# EAGLE design Circuit (EAGLE 5.00)
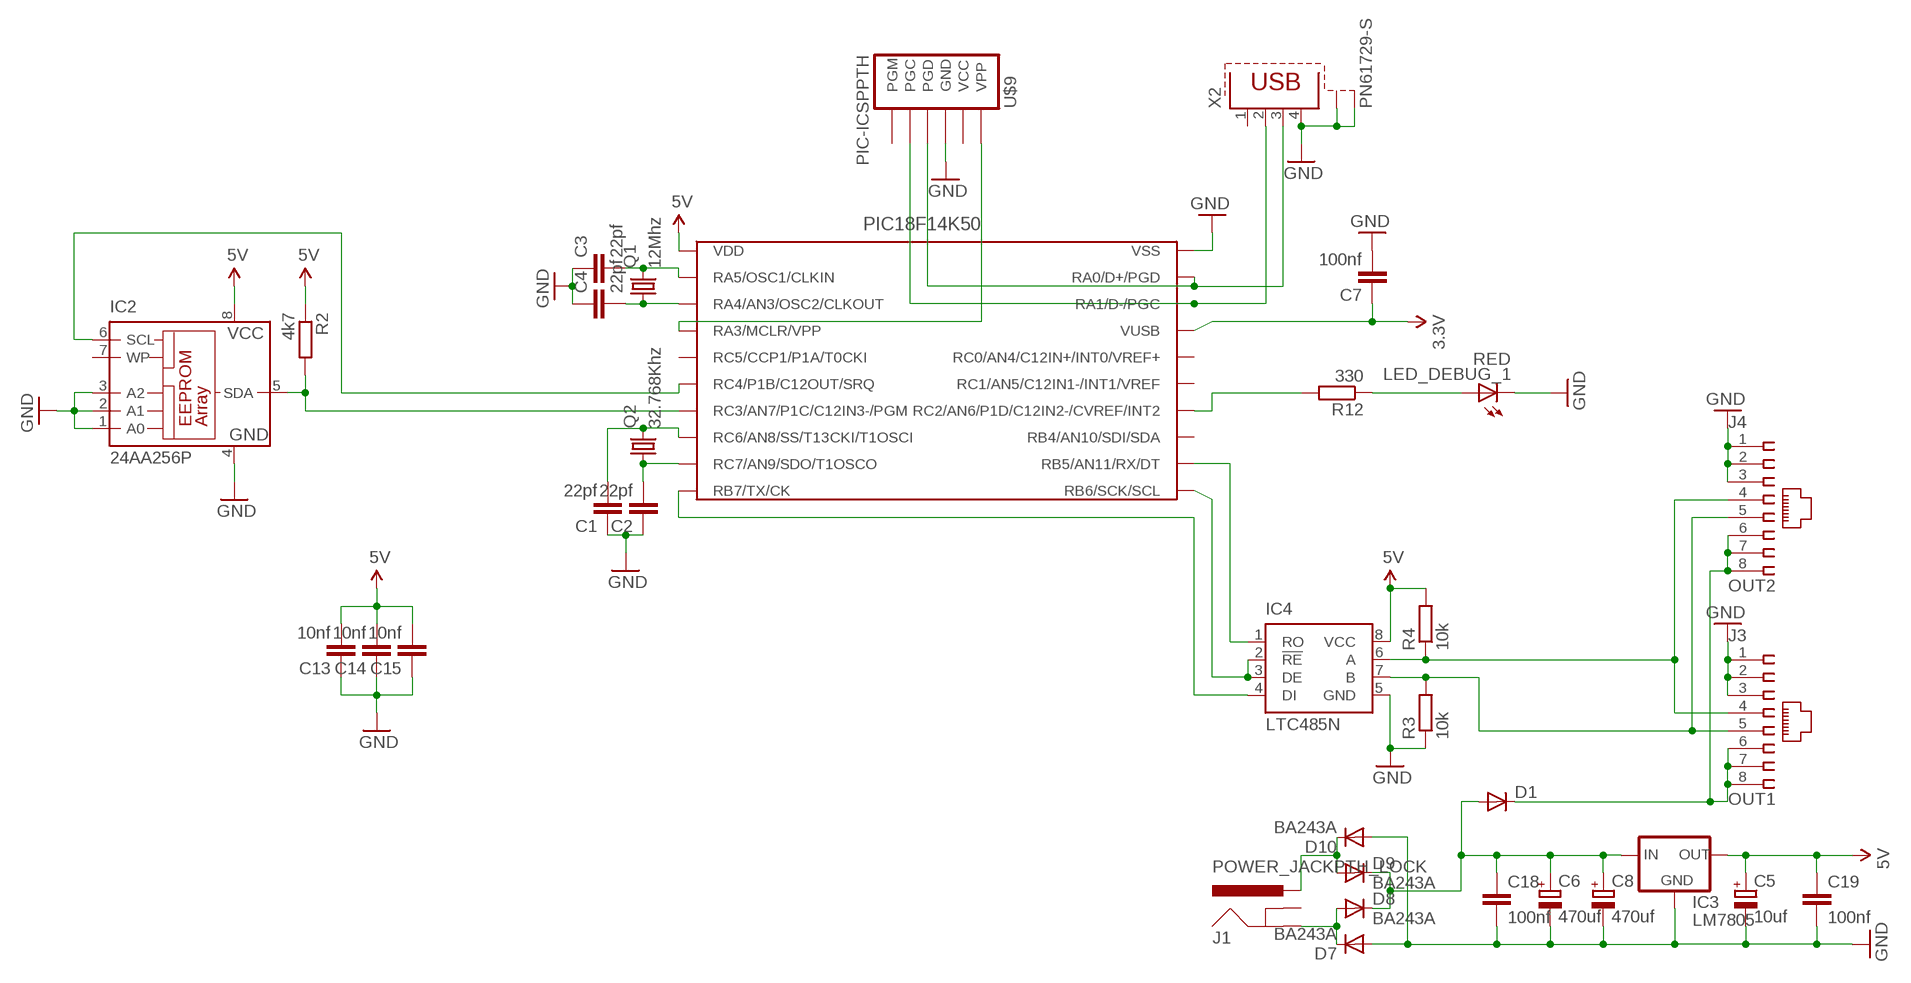
[diagram p0: schematic, sheet 1]

## Parts
C1  22pf  C-EU050-025X075  [C050-025X075]
C2  22pf  C-EU050-025X075  [C050-025X075]
C3  22pf  C-EU050-025X075  [C050-025X075]
C4  22pf  C-EU050-025X075  [C050-025X075]
C5  10uf  CPOL-EUE2.5-5  [E2,5-5]
C6  470uf  CPOL-EUE3.5-10  [E3,5-10]
C7  100nf  C2.5/2  [C2.5-2]
C8  470uf  CPOL-EUE3.5-10  [E3,5-10]
C13  10nf  C-EU050-025X075  [C050-025X075]
C14  10nf  C-EU050-025X075  [C050-025X075]
C15  10nf  C-EU050-025X075  [C050-025X075]
C18  100nf  C-EU050-025X075  [C050-025X075]
C19  100nf  C-EU050-025X075  [C050-025X075]
D1  DIODE-DO35-10  [DO35-10]
D7  BA243A  [DO35-10]
D8  BA243A  [DO35-10]
D9  BA243A  [DO35-10]
D10  BA243A  [DO35-10]
IC2  24AA256P  [DIL8]
IC3  LM7805  78XXL  [78XXL]
IC4  LTC485N  [DIL08]
J1  POWER_JACKPTH_LOCK  [POWER_JACK_PTH_LOCK]
J3  OUT1  215877-4  [215877-4]
J4  OUT2  215877-4  [215877-4]
LED_DEBUG_1  RED  LED5MM  [LED5MM]
Q1  12Mhz  CRYSTALHC49U70  [HC49U70]
Q2  32.768Khz  CRYSTALTC38H  [TC38H]
R2  4k7  R-EU_0204/7  [0204/7]
R3  10k  R-EU_0204/7  [0204/7]
R4  10k  R-EU_0204/7  [0204/7]
R12  330  R-EU_0204/7  [0204/7]
U$1  D.2.18F14K50  [E.18F14K50]
U$9  PIC-ICSPPTH  [MOLEX-1X6]
X2  PN61729-S  [PN61729-S]

## Nets
3.3V: C7.1 U$1.VUSB
5V: C5.+ C13.2 C14.2 C15.2 C19.1 IC2.8(VCC) IC3.OUT IC4.8(VCC) R2.1 R4.2 U$1.VDD
12V: C6.+ C8.+ C18.1 D1.A D8.C D9.C IC3.IN
GND: C1.1 C2.1 C3.1 C4.1 C5.- C6.- C7.2 C8.- C13.1 C14.1 C15.1 C18.2 C19.2 D7.A D10.A IC2.1(A0) IC2.2(A1) IC2.3(A2) IC2.4(GND) IC3.GND IC4.5(GND) J3.1 J3.2 J3.3 J4.1 J4.2 J4.3 LED_DEBUG_1.K(C) R3.1 U$1.VSS U$9.4(GND) X2.4 X2.S1 X2.S2
N$1: IC2.6(SCL) U$1.RC4/P1B/C12OUT/SRQ
N$2: LED_DEBUG_1.A R12.1
N$4: D7.C D8.A J1.GND
N$5: IC4.1(RO) U$1.RB5/AN11/RX/DT
N$6: IC4.6(A) J3.4 J4.4 R4.1
N$7: IC4.2(!RE) IC4.3(DE) U$1.RB6/SCK/SCL
N$8: D9.A D10.C J1.PWR
N$9: C1.2 Q2.2 U$1.RC6/AN8/SS/T13CKI/T1OSCI
N$10: C2.2 Q2.1 U$1.RC7/AN9/SDO/T1OSCO
N$12: IC2.5(SDA) R2.2 U$1.RC3/AN7/P1C/C12IN3-/PGM
N$13: IC4.7(B) J3.5 J4.5 R3.2
N$14: C4.2 Q1.1 U$1.RA4/AN3/OSC2/CLKOUT
N$15: C3.2 Q1.2 U$1.RA5/OSC1/CLKIN
N$19: D1.C J3.6 J3.7 J3.8 J4.6 J4.7 J4.8
N$28: U$1.RA3/MCLR/VPP U$9.6(VPP)
N$38: U$1.RA0/D+/PGD U$9.3(PGD) X2.3
N$39: U$1.RA1/D-/PGC U$9.2(PGC) X2.2
N$41: IC4.4(DI) U$1.RB7/TX/CK
N$67: R12.2 U$1.RC2/AN6/P1D/C12IN2-/CVREF/INT2
Unconnected: IC2.7(WP) J1.GNDBREAK U$1.RB4/AN10/SDI/SDA U$1.RC0/AN4/C12IN+/INT0/VREF+ U$1.RC1/AN5/C12IN1-/INT1/VREF U$1.RC5/CCP1/P1A/T0CKI U$9.1(PGM) U$9.5(VCC) X2.1

## Library data of the parts
C1-C4 C13-C15 C18 C19 = rcl:C-EU: CAPACITOR, European symbol
C5 C6 C8 = rcl:CPOL-EU: POLARIZED CAPACITOR, European symbol
C7 = capacitor-wima:C: CAPACITOR naming: grid - package width
D1 = diode:DIODE-: DIODE
D7-D10 = diode:BA243A: DIODE
IC2 = microchip:24*: Serial EEPROM I2C
IC3 = v-reg:78XXL: VOLTAGE REGULATOR
IC4 = linear-technology:LTC485: Low Power RS485 Interface Transceiver Source: http://www.linear.com/pc/downloadDocument.do?navId=H0,C1,C1007,C1017,P2064,D1718
J1 = SparkFun:POWER_JACK: Power Jack This is the standard 5.5mm barrel jack for power. The PTH is the most common, proven, reliable, footprint. All others are experimental. The Slot footprint only works if the mill layer is transmitted to the PCB fab house so be warned. Spark Fun Electronics SKU : PRT-00119. Mating wall wart : TOL-00298 (and others)
J3 J4 = con-amp:215877-4: AMP connector
LED_DEBUG_1 = led:LED: LED OSRAM: - CHIPLED LG R971, LG N971, LY N971, LG Q971, LY Q971, LO R971, LY R971 LH N974, LH R974 LS Q976, LO Q976, LY Q976 LO Q996 - Hyper CHIPLED LW Q18S LB Q993, LB Q99A, LB R99A - SideLED LS A670, LO A670, LY A670, LG A670, LP A670 LB A673, LV A673, LT A673, LW A673 LH A674 LY A675 LS A676, LA A676, LO A676, LY A676, LW A676 LS A679, LY A679, LG A679 - Hyper Micro SIDELED® LS Y876, LA Y876, LO Y876, LY Y876 LT Y87S - SmartLED LW L88C, LW L88S LB L89C, LB L89S, LG L890 LS L89K, LO L89K, LY L89K LS L896, LA L896, LO L896, LY L896 - TOPLED LS T670, LO T670, LY T670, LG T670, LP T670 LSG T670, LSP T670, LSY T670, LOP T670, LYG T670 LG T671, LOG T671, LSG T671 LB T673, LV T673, LT T673, LW T673 LH T674 LS T676, LA T676, LO T676, LY T676, LB T676, LH T676, LSB T676, LW T676 LB T67C, LV T67C, LT T67C, LS T67K, LO T67K, LY T67K, LW E67C LS E67B, LA E67B, LO E67B, LY E67B, LB E67C, LV E67C, LT E67C LW T67C LS T679, LY T679, LG T679 LS T770, LO T770, LY T770, LG T770, LP T770 LB T773, LV T773, LT T773, LW T773 LH T774 LS E675, LA E675, LY E675, LS T675 LS T776, LA T776, LO T776, LY T776, LB T776 LHGB T686 LT T68C, LB T68C - Hyper Mini TOPLED® LB M676 - Mini TOPLED Santana® LG M470 LS M47K, LO M47K, LY M47K Source: http://www.osram.convergy.de LUXEON: - LUMILED® LXK2-PW12-R00, LXK2-PW12-S00, LXK2-PW14-U00, LXK2-PW14-V00 LXK2-PM12-R00, LXK2-PM12-S00, LXK2-PM14-U00 LXK2-PE12-Q00, LXK2-PE12-R00, LXK2-PE12-S00, LXK2-PE14-T00, LXK2-PE14-U00 LXK2-PB12-K00, LXK2-PB12-L00, LXK2-PB12-M00, LXK2-PB14-N00, LXK2-PB14-P00, LXK2-PB14-Q00 LXK2-PR12-L00, LXK2-PR12-M00, LXK2-PR14-Q00, LXK2-PR14-R00 LXK2-PD12-Q00, LXK2-PD12-R00, LXK2-PD12-S00 LXK2-PH12-R00, LXK2-PH12-S00 LXK2-PL12-P00, LXK2-PL12-Q00, LXK2-PL12-R00 Source: www.luxeon.com KINGBRIGHT: KA-3528ASYC Source: www.kingbright.com
Q1 Q2 = crystal:CRYSTAL: CRYSTAL
R2 = resistor:R-EU_: RESISTOR, European symbol
R3 R4 R12 = rcl:R-EU_: RESISTOR, European symbol
U$1 = pic18f14k50:D.2.18F14K50
U$9 = SparkFun:PIC-ICSP: ISCP Programming connector for UAV, UBW Kit, etc.
X2 = con-berg:PN61729-S: BERG USB connector

## Board
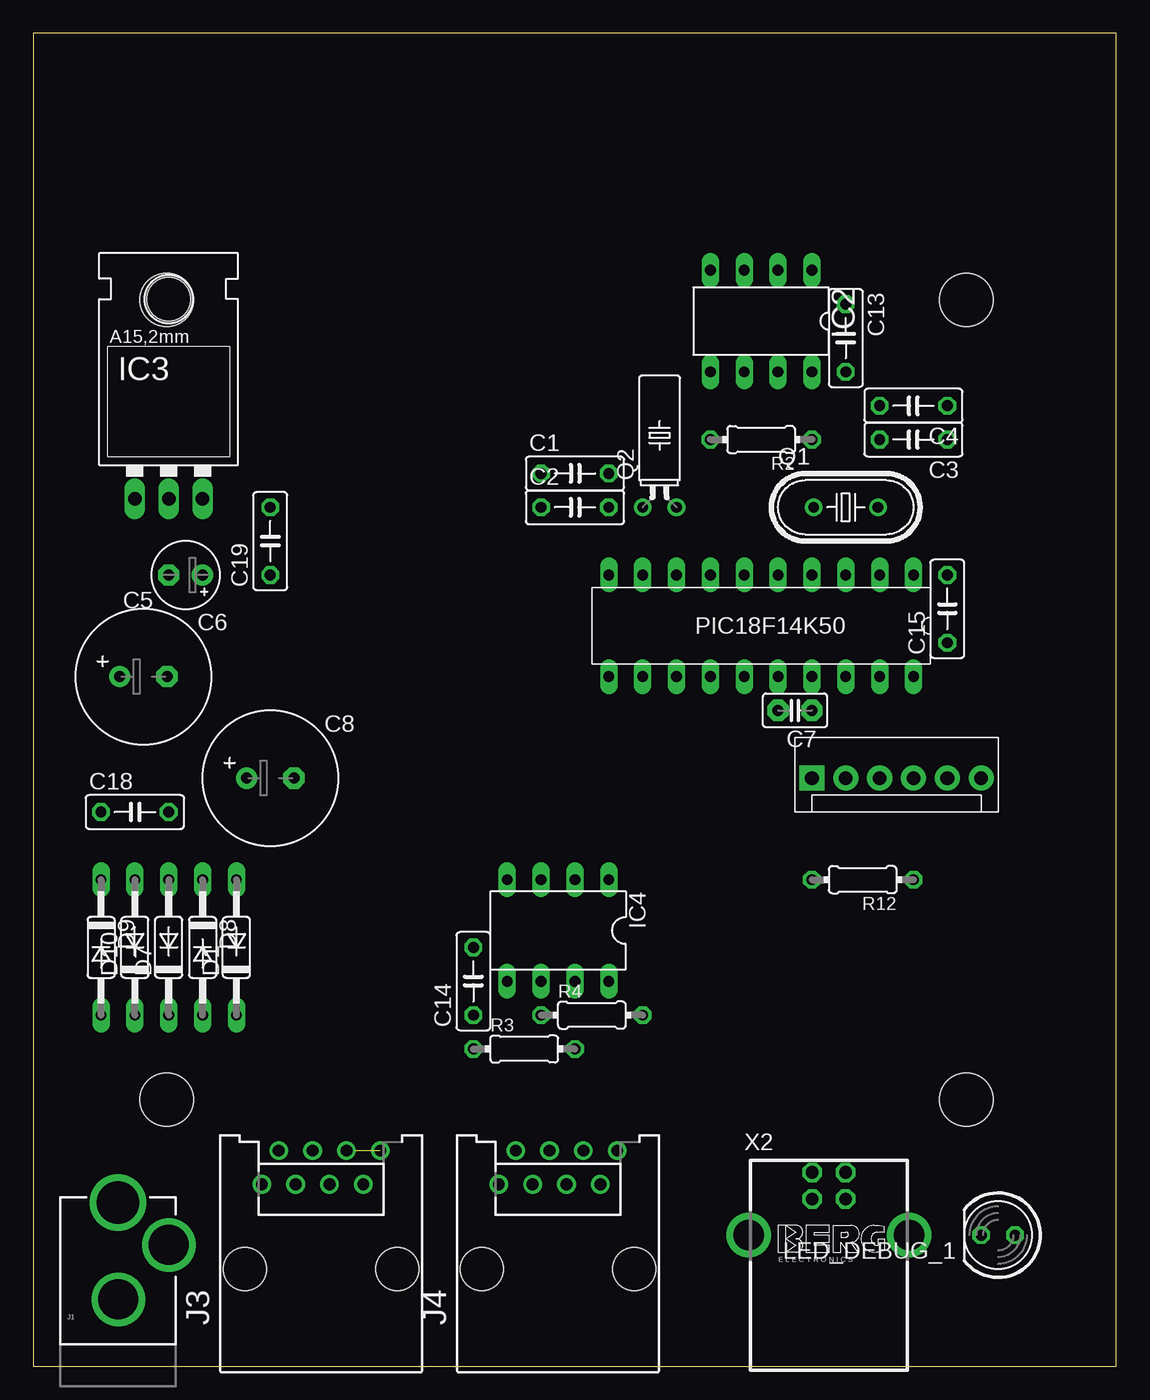
[diagram p1: board, top side]
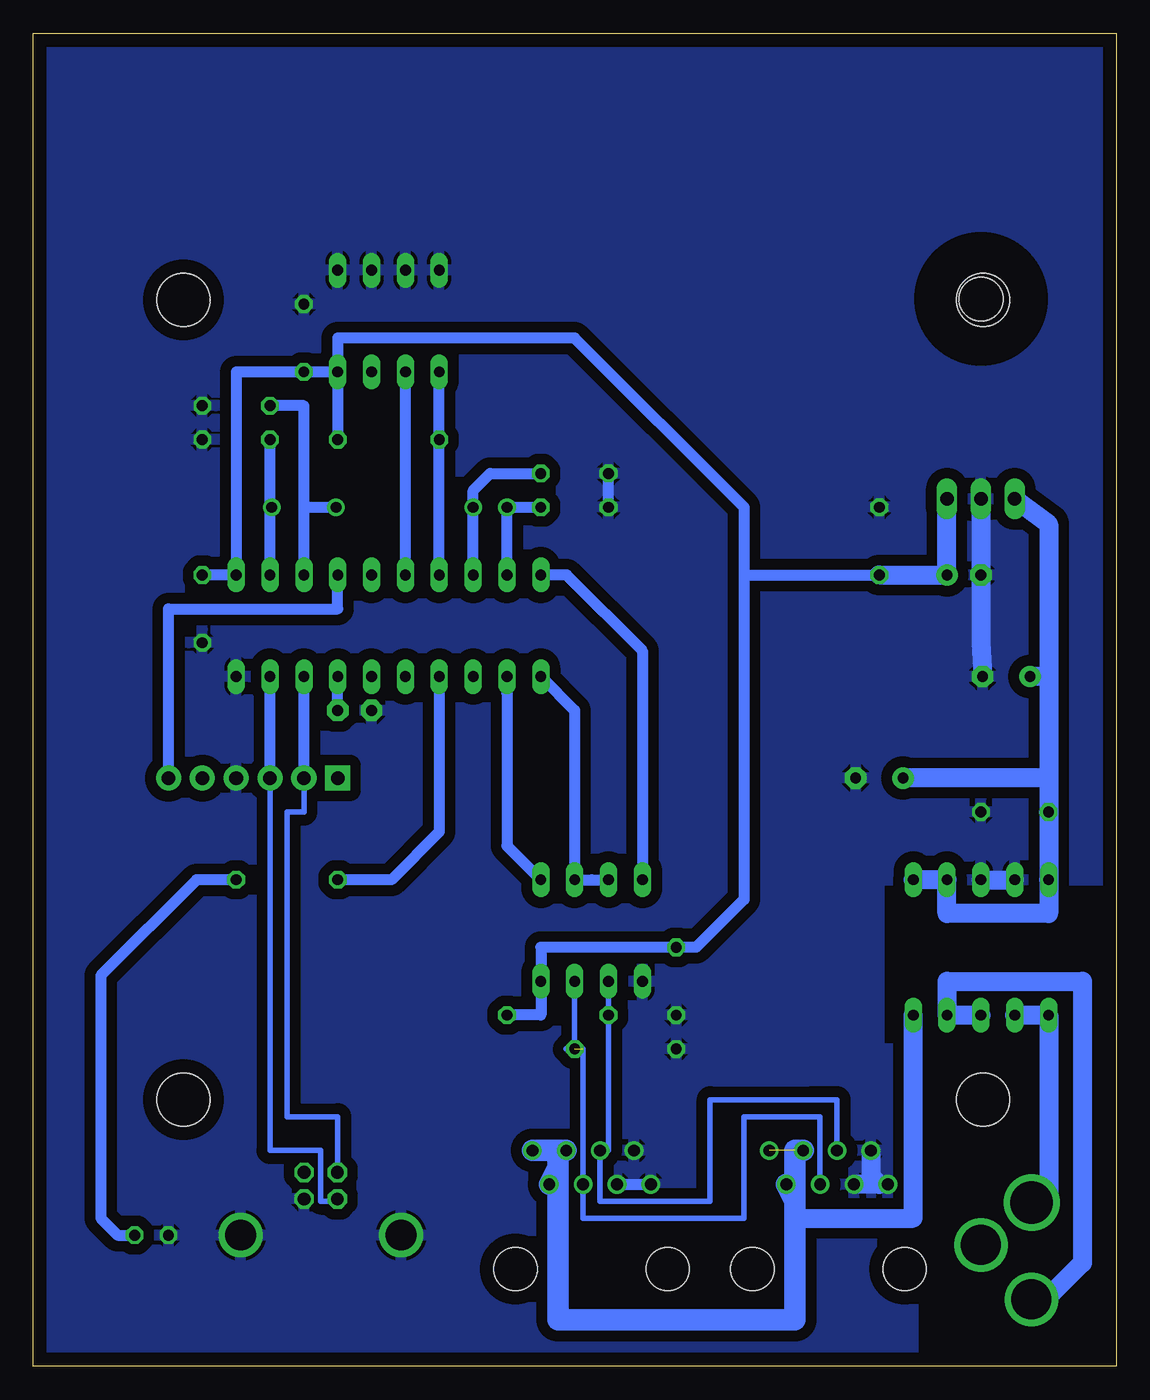
[diagram p2: board, bottom side, seen from below]

Size 81.26 x 100 mm. Coordinates in mm from the lower left corner, seen from the top.
Outline: 0,0 81.26,0 81.26,100 0,100 0,0
Copper layers (1*16): Top 0.035mm / dielectric 1.5mm / Bottom 0.035mm
Design rules "default": minimum track width 10mil, minimum drill 24mil, track to track 8mil, track to pad 8mil, pad to pad 8mil, via to via 8mil, smd to smd 8mil, copper to edge 40mil, drill to drill 8mil, minimum pad ring 10mil, minimum via ring 8mil, stop-mask expansion 4mil, vias tented up to drill 0mil, thermal gap 10mil
Holes 4 mm at 10,80 10,20 70,20 70,80

### Footprints (pad centres in the part's own frame; a part is rotated, then mirrored left to right if it is on the bottom)
C050-025X075 = drill 0.813 octagon: 1 -2.54,0; 2 2.54,0
E2,5-5 = drill 0.813 pad 1.6 round: + -1.27,0 | drill 0.813 pad 1.6 octagon: - 1.27,0
E3,5-10 = drill 0.813 pad 1.6 round: + -1.778,0 | drill 0.813 pad 1.6 octagon: - 1.778,0
C2.5-2 = drill 0.813 pad 1.6 octagon: 1 -1.27,0; 2 1.27,0
DO35-10 = drill 0.813 long: A 5.08,0; C -5.08,0
DIL8 = drill 0.813 long: 1 -3.81,-3.81; 2 -1.27,-3.81; 3 1.27,-3.81; 4 3.81,-3.81; 5 3.81,3.81; 6 1.27,3.81; 7 -1.27,3.81; 8 -3.81,3.81
78XXL = drill 1.016 long: GND 0,-3.81; IN -2.54,-3.81; OUT 2.54,-3.81 | hole 3.302: 0,11.176
DIL08 = drill 0.813 long: 1 -3.81,-3.81; 2 -1.27,-3.81; 3 1.27,-3.81; 4 3.81,-3.81; 5 3.81,3.81; 6 1.27,3.81; 7 -1.27,3.81; 8 -3.81,3.81
POWER_JACK_PTH_LOCK = drill 2.997 round: GND 0.025,6.608; GNDBREAK 3.812,10.7 | drill 3.2 round: PWR 0,13.878
215877-4 = drill 0.889 round: 1 -4.445,6.35; 2 -3.175,8.89; 3 -1.905,6.35; 4 -0.635,8.89; 5 0.635,6.35; 6 1.905,8.89; 7 3.175,6.35; 8 4.445,8.89 | hole 3.251: -5.715,0; 5.715,0
LED5MM = drill 0.813 octagon: A -1.27,0; K 1.27,0
HC49U70 = drill 0.813 round: 1 -2.413,0; 2 2.413,0
TC38H = drill 0.813 round: 1 -1.27,0; 2 1.27,0
0204/7 = drill 0.813 octagon: 1 -3.81,0; 2 3.81,0
E.18F14K50 = drill 0.8 long: RA0/D+/PGD -7.62,3.81; RA1/D-/PGC -5.08,3.81; RA3/MCLR/VPP -2.54,-3.81; RA4/AN3/OSC2/CLKOUT -5.08,-3.81; RA5/OSC1/CLKIN -7.62,-3.81; RB4/AN10/SDI/SDA 7.62,3.81; RB5/AN11/RX/DT 10.16,3.81; RB6/SCK/SCL 12.7,3.81; RB7/TX/CK 12.7,-3.81; RC0/AN4/C12IN+/INT0/VREF+ 0,3.81; RC1/AN5/C12IN1-/INT1/VREF 2.54,3.81; RC2/AN6/P1D/C12IN2-/CVREF/INT2 5.08,3.81; RC3/AN7/P1C/C12IN3-/PGM 5.08,-3.81; RC4/P1B/C12OUT/SRQ 2.54,-3.81; RC5/CCP1/P1A/T0CKI 0,-3.81; RC6/AN8/SS/T13CKI/T1OSCI 7.62,-3.81; RC7/AN9/SDO/T1OSCO 10.16,-3.81; VDD -10.16,-3.81; VSS -10.16,3.81; VUSB -2.54,3.81
MOLEX-1X6 = drill 1.016 pad 1.88 square: 1 0,0 | drill 1.016 pad 1.88 round: 2 2.54,0; 3 5.08,0; 4 7.62,0; 5 10.16,0; 6 12.7,0
PN61729-S = drill 0.95 octagon: 1 1.25,4.71; 2 -1.25,4.71; 3 -1.25,2.71; 4 1.25,2.71 | drill 2.3 pad 2.9 round: S1 -6.02,0; S2 6.02,0

### Placement (x,y rotation side)
C1  40.64,66.98 0 top
C2  40.64,64.44 0 top
C3  66.04,69.52 180 top
C4  66.04,72.06 180 top
C5  11.43,59.36 180 top
C6  8.26,51.74 0 top
C7  57.15,49.2 180 top
C8  17.78,44.12 0 top
C13  60.96,77.14 270 top
C14  33.02,28.88 90 top
C15  68.58,56.82 90 top
C18  7.62,41.58 0 top
C19  17.78,61.9 90 top
D1  15.24,31.42 90 top
D7  10.16,31.42 90 top
D8  12.7,31.42 270 top
D9  5.08,31.42 270 top
D10  7.62,31.42 90 top
IC2  54.61,78.41 180 top
IC3  10.16,68.89 0 top
IC4  39.37,32.69 180 top
J1  6.35,-1.6 0 top
J3  21.59,7.29 0 top
J4  39.37,7.29 0 top
LED_DEBUG_1  72.39,9.83 180 top
Q1  60.96,64.44 0 top
Q2  46.99,64.44 0 top
R2  54.61,69.52 180 top
R3  36.83,23.8 0 top
R4  41.91,26.34 0 top
R12  62.23,36.5 180 top
U$1  55.88,55.55 180 top
U$9  58.42,44.12 0 top
X2  59.69,9.83 0 top

### Tracks (layer width: path | path; a pad name or v marks a point on that pad's centre or on a via)
3.3V
  Bottom 0.813: C7.1 U$1.VUSB
5V
  Bottom 0.813: IC2.8 R2.1 IC2.8 | IC2.8 C13.2 | R4.2 43.18,26.34 IC4.8 43.18,31.42 C14.2 31.53,31.42 27.94,35.01 27.94,59.36 | IC2.8 58.42,77.14 40.64,77.14 27.94,64.44 27.94,59.36 | 27.94,59.36 C19.1 | C15.2 U$1.VDD 66.04,74.6 IC2.8
  Bottom 1.422: IC3.OUT C5.+ C19.1
12V
  Bottom 1.422: 5.08,51.74 5.08,44.12 | 5.08,44.12 C18.1 D9.C 5.08,33.96 12.7,33.96 D8.C D1.A | 5.08,51.74 C6.+ | IC3.IN 5.08,63.17 5.08,51.74 | 5.08,44.12 C8.+
GND
  Bottom 0.813: J4.3 J4.1 | C2.1 C1.1
  Bottom 1.422: D7.A D10.A | C6.- 10.16,54.28 C5.- IC3.GND | J3.3 17.78,13.64 18.41,14.28 J3.2
  pour Bottom (isolate 0.813): -2.54,36.5 -2.54,101.27 88.9,101.27 87.63,-4.14 15.24,-4.14 15.24,23.8 17.78,23.8 17.78,36.5
N$1
  Bottom 0.813: U$1.RC4/P1B/C12OUT/SRQ IC2.6
N$2
  Bottom 0.813: R12.1 69.02,36.5 76.2,29.32 76.2,11.1 74.93,9.83 LED_DEBUG_1.A
N$4
  Bottom 1.422: D7.C D8.A 12.7,28.88 2.54,28.88 2.54,7.74 5.27,5.01 J1.GND
N$5
  Bottom 0.813: 45.72,50.47 U$1.RB5/AN11/RX/DT 45.72,39.04 IC4.1
N$6
  Bottom 0.406: IC4.6 R4.1 38.1,16.18 J4.4 38.73,12.37 30.48,12.37 30.48,19.99 20.95,19.99 | 20.95,19.99 J3.4 | 20.95,19.99 22.86,19.99
N$7
  Bottom 0.813: IC4.2 39.37,36.5 | IC4.2 IC4.3 | U$1.RB6/SCK/SCL 40.64,49.2 IC4.2
N$8
  Bottom 1.422: D9.A D10.C D9.A | J1.PWR 5.08,12.28 D9.A
N$9
  Bottom 0.813: C1.2 46.99,66.98 48.26,65.71 Q2.2 U$1.RC6/AN8/SS/T13CKI/T1OSCI
N$10
  Bottom 0.813: C2.2 Q2.1 U$1.RC7/AN9/SDO/T1OSCO
N$12
  Bottom 0.813: U$1.RC3/AN7/P1C/C12IN3-/PGM R2.2 IC2.5
N$13  (1 unrouted)
  Bottom 0.406: IC4.7 R3.2 | J3.5 22.23,18.72 27.94,18.72 27.94,11.1 40.01,11.1 J4.5 40.01,23.8 41.27,23.8
N$14
  Bottom 0.813: U$1.RA4/AN3/OSC2/CLKOUT 60.96,64.44 | 60.96,64.44 Q1.1 | 60.96,64.44 60.96,72.06 C4.2
N$15
  Bottom 0.813: U$1.RA5/OSC1/CLKIN 63.5,64.44 | 63.5,64.44 C3.2 | 63.5,64.44 Q1.2
N$19  (1 unrouted)
  Bottom 1.422: 24.13,11.1 15.24,11.1 D1.C
  Bottom 1.626: J4.6 J4.8 41.91,16.18 | 41.91,16.18 41.91,14.91 J4.7 | J3.6 24.13,16.18 24.13,12.37 | 24.13,12.37 J3.7 | 41.91,16.18 41.91,3.48 24.13,3.48 24.13,11.1 24.13,12.37
N$28
  Bottom 0.813: U$1.RA3/MCLR/VPP 58.42,56.82 71.12,56.82 U$9.6
N$38
  Bottom 0.406: X2.3 58.42,12.54 58.42,12.37 59.69,12.37 59.69,16.18 63.5,16.18 U$9.3
  Bottom 0.813: U$9.3 U$1.RA0/D+/PGD
N$39
  Bottom 0.406: X2.2 58.42,14.54 58.42,18.72 62.23,18.72 62.23,41.58 60.96,41.58 U$9.2
  Bottom 0.813: U$9.2 U$1.RA1/D-/PGC U$9.2
N$41
  Bottom 0.813: U$1.RB7/TX/CK 41.24,59.36 35.56,53.68 IC4.4
N$67
  Bottom 0.813: U$1.RC2/AN6/P1D/C12IN2-/CVREF/INT2 50.8,40.09 54.39,36.5 R12.2
(copper drawn outside any net)
  shapes: Bottom circle x4